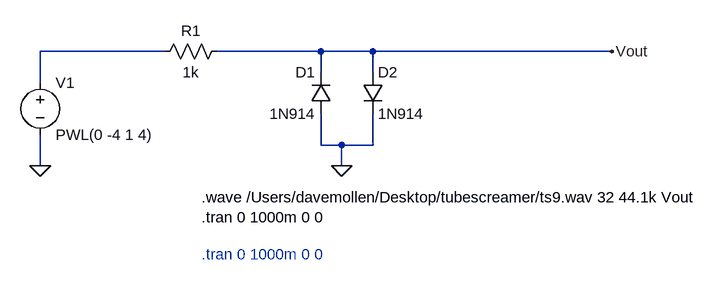
[diagram p0: schematic clipper.asc]
clipper.asc, the LTspice schematic file:
Version 4
SHEET 1 1092 680
WIRE -144 144 -336 144
WIRE 96 144 -64 144
WIRE 176 144 96 144
WIRE 544 144 176 144
WIRE 96 176 96 144
WIRE 176 176 176 144
WIRE -336 192 -336 144
WIRE 96 288 96 240
WIRE 128 288 96 288
WIRE 176 288 176 240
WIRE 176 288 128 288
WIRE -336 320 -336 272
WIRE 128 320 128 288
FLAG -336 320 0
FLAG 544 144 Vout
FLAG 128 320 0
SYMBOL res -48 128 R90
WINDOW 0 0 56 VBottom 2
WINDOW 3 32 56 VTop 2
SYMATTR InstName R1
SYMATTR Value 1k
SYMBOL voltage -336 176 R0
SYMATTR InstName V1
SYMATTR Value PWL(0 -4 1 4)
SYMBOL diode 112 240 R180
WINDOW 0 24 64 Left 2
WINDOW 3 24 0 Left 2
SYMATTR InstName D1
SYMATTR Value 1N914
SYMBOL diode 160 176 R0
SYMATTR InstName D2
SYMATTR Value 1N914
TEXT -88 368 Left 2 !.wave /Users/davemollen/Desktop/tubescreamer/ts9.wav 32 44.1k Vout\n.tran 0 1000m 0 0
TEXT -88 456 Left 2 ;.tran 0 1000m 0 0

The netlist it stands for:
* clipper.asc
R1 Vout N001 1k
V1 N001 0 PWL(0 -4 1 4)
D1 0 Vout 1N914
D2 Vout 0 1N914
.model D D
.lib standard.dio
.wave /Users/davemollen/Desktop/tubescreamer/ts9.wav 32 44.1k Vout
.tran 0 1000m 0 0
* .tran 0 1000m 0 0
.backanno
.end